# EAGLE schematic Coil_sensor_board (EAGLE 6.2)
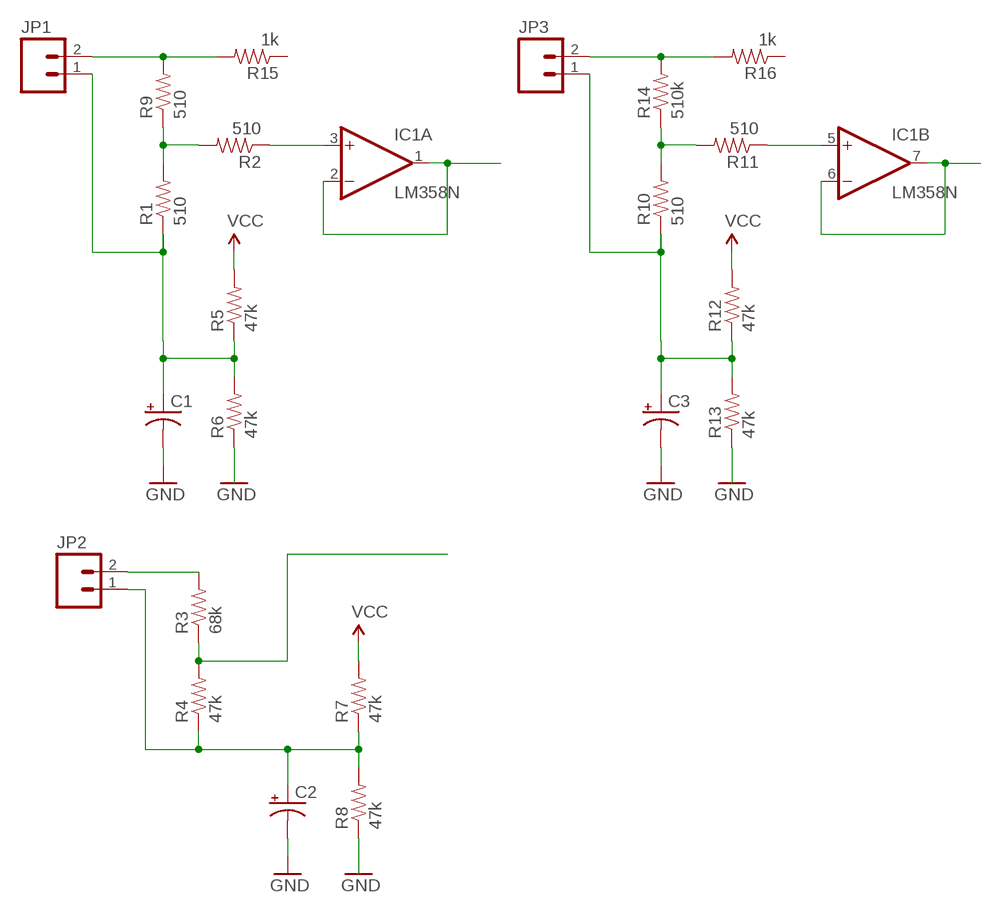
[diagram p0: schematic, sheet 1]

## Parts
C1  CAP_POLPTH1  [CPOL-RADIAL-100UF-25V]
C2  CAP_POLPTH1  [CPOL-RADIAL-100UF-25V]
C3  CAP_POLPTH1  [CPOL-RADIAL-100UF-25V]
IC1  LM358N  [DIL08]
JP1  M02PTH  [1X02]
JP2  M02PTH  [1X02]
JP3  M02PTH  [1X02]
R1  510  RESISTORPTH-1/6W  [1/6W-RES]
R2  510  RESISTORPTH-1/6W  [1/6W-RES]
R3  68k  RESISTORPTH-1/6W  [1/6W-RES]
R4  47k  RESISTORPTH-1/6W  [1/6W-RES]
R5  47k  RESISTORPTH-1/6W  [1/6W-RES]
R6  47k  RESISTORPTH-1/6W  [1/6W-RES]
R7  47k  RESISTORPTH-1/6W  [1/6W-RES]
R8  47k  RESISTORPTH-1/6W  [1/6W-RES]
R9  510  RESISTORPTH-1/6W  [1/6W-RES]
R10  510  RESISTORPTH-1/6W  [1/6W-RES]
R11  510  RESISTORPTH-1/6W  [1/6W-RES]
R12  47k  RESISTORPTH-1/6W  [1/6W-RES]
R13  47k  RESISTORPTH-1/6W  [1/6W-RES]
R14  510k  RESISTORPTH-1/6W  [1/6W-RES]
R15  1k  RESISTORPTH-1/6W  [1/6W-RES]
R16  1k  RESISTORPTH-1/6W  [1/6W-RES]

## Nets
GND: C1.2(-) C2.2(-) C3.2(-) R6.1 R8.1 R13.1
N$1: C1.1(+) JP1.1 R1.1 R5.1 R6.2
N$2: IC1.3(A:+IN) R2.1
N$3: JP1.2 R9.2 R15.2
N$4: C3.1(+) JP3.1 R10.1 R12.1 R13.2
N$5: JP2.2 R3.2
N$6: IC1.1(A:OUT) IC1.2(A:-IN)
N$7: R1.2 R2.2 R9.1
N$8: IC1.5(B:+IN) R11.1
N$9: C2.1(+) JP2.1 R4.1 R7.1 R8.2
N$10: R10.2 R11.2 R14.1
N$11: R3.1 R4.2
N$12: JP3.2 R14.2 R16.2
N$13: IC1.6(B:-IN) IC1.7(B:OUT)
VCC: R5.2 R7.2 R12.2
Unconnected: R15.1 R16.1

## Power pins joined to a net without a drawn wire
V+: IC1.8(P:V+)
V-: IC1.4(P:V-)

## Library data of the parts
C1-C3 = SparkFun:CAP_POL: Capacitor Polarized These are standard SMD and PTH capacitors. Normally 10uF, 47uF, and 100uF in electrolytic and tantalum varieties. Always verify the external diameter of the through hole cap, it varies with capacity, voltage, and manufacturer. The EIA devices should be standard.
IC1 = linear:LM358: OP AMP also LM158; LM258; LM2904 Source: http://cache.national.com/ds/LM/LM158.pdf
JP1-JP3 = SparkFun:M02: Header 2 Standard 2-pin 0.1" header. Use with straight break away headers (SKU : PRT-00116), right angle break away headers (PRT-00553), swiss pins (PRT-00743), machine pins (PRT-00117), and female headers (PRT-00115). Molex polarized connector foot print use with SKU : PRT-08233 with associated crimp pins and housings.
R1-R16 = SparkFun:RESISTOR: Resistor Basic schematic elements and footprints for 0603, 1206, and PTH resistors.